# Altium project Urukul.PrjPCB (part 3 of 4)

## Sheet LEDs.SchDoc: =DocumentName
size A4; DocumentNumber: 1; Revision: 0; SheetNumber: 5; SheetTotal: 20
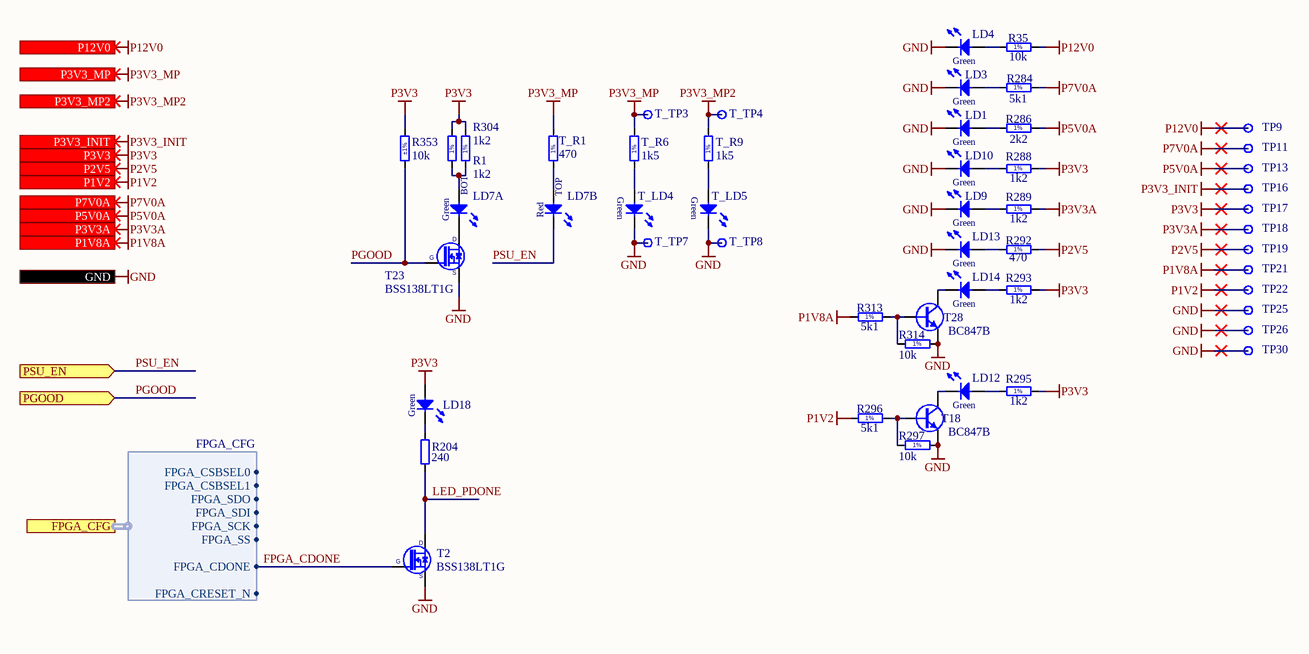
[diagram p4: LEDs.SchDoc]

### Parts
LD1  Green  [LED_KINGBRIGHT_KPH-1608CGCK]
LD3  Green  [LED_KINGBRIGHT_KPH-1608CGCK]
LD4  Green  [LED_KINGBRIGHT_KPH-1608CGCK]
LD7  Red/Green  [LED_DIALIGHT_571-0112F]  (value not drawn)  (parts A,B of 2)
LD9  Green  [LED_KINGBRIGHT_KPH-1608CGCK]
LD10  Green  [LED_KINGBRIGHT_KPH-1608CGCK]
LD12  Green  [LED_KINGBRIGHT_KPH-1608CGCK]
LD13  Green  [LED_KINGBRIGHT_KPH-1608CGCK]
LD14  Green  [LED_KINGBRIGHT_KPH-1608CGCK]
LD18  Green  [LED_AVAGO_HSME-C120]
R1  1k2  [RESC1608X55N]
R35  10k  [RESC1005X40N]
R204  240  [RESC1005X40N]
R284  5k1  [RESC1005X40N]
R286  2k2  [RESC1005X40N]
R288  1k2  [RESC1608X55N]
R289  1k2  [RESC1608X55N]
R292  470  [RESC1005X40N]
R293  1k2  [RESC1608X55N]
R295  1k2  [RESC1608X55N]
R296  5k1  [RESC1005X40N]
R297  10k  [RESC1005X40N]
R304  1k2  [RESC1608X55N]
R313  5k1  [RESC1005X40N]
R314  10k  [RESC1005X40N]
R353  10k  Tolerance: ±1%  [RESC1005X40N]
T2  BSS138LT1G  [SOT95P240X110-3N]
T18  BC847B  [SOT95P230X110-3N]
T23  BSS138LT1G  [SOT95P240X110-3N]
T28  BC847B  [SOT95P230X110-3N]
T_LD4  Green  [LED_KINGBRIGHT_KPH-1608CGCK]  (value not drawn)
T_LD5  Green  [LED_KINGBRIGHT_KPH-1608CGCK]  (value not drawn)
T_R1  470  [RESC1005X40N]
T_R6  1k5  [RESC1608X55N]
T_R9  1k5  [RESC1608X55N]
T_TP3  Test Point  [TPS127]  (value not drawn)  (no BOM)
T_TP4  Test Point  [TPS127]  (value not drawn)  (no BOM)
T_TP7  Test Point  [TPS127]  (value not drawn)  (no BOM)
T_TP8  Test Point  [TPS127]  (value not drawn)  (no BOM)
TP9  Test Point  [TPS127]  (value not drawn)  (no BOM)
TP11  Test Point  [TPS127]  (value not drawn)  (no BOM)
TP13  Test Point  [TPS127]  (value not drawn)  (no BOM)
TP16  Test Point  [TPS127]  (value not drawn)  (no BOM)
TP17  Test Point  [TPS127]  (value not drawn)  (no BOM)
TP18  Test Point  [TPS127]  (value not drawn)  (no BOM)
TP19  Test Point  [TPS127]  (value not drawn)  (no BOM)
TP21  Test Point  [TPS127]  (value not drawn)  (no BOM)
TP22  Test Point  [TPS127]  (value not drawn)  (no BOM)
TP25  Test Point  [TPS127]  (value not drawn)  (no BOM)
TP26  Test Point  [TPS127]  (value not drawn)  (no BOM)
TP30  Test Point  [TPS127]  (value not drawn)  (no BOM)

### Ports
FPGA_CFG (harness FPGA_CFG), GND, P1V2 (in), P1V8A (in), P2V5 (in), P3V3 (in), P3V3_INIT (in), P3V3_MP2 (in), P3V3_MP (in), P3V3A (in), P5V0A (in), P7V0A (in), P12V0 (in), PGOOD (in), PSU_EN (in)

### Harnesses
FPGA_CFG: FPGA_CSBSEL0, FPGA_CSBSEL1, FPGA_SDO, FPGA_SDI, FPGA_SCK, FPGA_SS, FPGA_CDONE, FPGA_CRESET_N

### Nets
GND: LD1.1(C) LD3.1(C) LD4.1(C) LD9.1(C) LD10.1(C) LD13.1(C) R297.2 R314.2 T2.2(S) T18.2(E) T23.2(S) T28.2(E) T_LD4.1(C) T_LD5.1(C) T_TP7.1 T_TP8.1 TP25.1 TP26.1 TP30.1 ; port GND
P1V2: R296.1 TP22.1 ; port P1V2
P1V8A: R313.1 TP21.1 ; port P1V8A
P2V5: R292.1 TP19.1 ; port P2V5
P3V3: LD18.2(A) R1.2 R288.2 R293.2 R295.2 R304.2 R353.2 TP17.1 ; port P3V3
P3V3_INIT: TP16.1 ; port P3V3_INIT
P3V3_MP: T_R1.1 T_R6.2 T_TP3.1 ; port P3V3_MP
P3V3_MP2: T_R9.2 T_TP4.1 ; port P3V3_MP2
P3V3A: R289.2 TP18.1 ; port P3V3A
P5V0A: R286.2 TP13.1 ; port P5V0A
P7V0A: R284.2 TP11.1 ; port P7V0A
P12V0: R35.2 TP9.1 ; port P12V0
FPGA_CDONE: T2.1(G) ; port FPGA_CFG.FPGA_CDONE  [project net FPGA_CFG.FPGA_CDONE]
LED_PDONE: R204.1 T2.3(D)
PGOOD: R353.1 T23.1(G) ; port PGOOD  [project net PGOOD_AFE]
PSU_EN: LD7.3(C) ; port PSU_EN
NetLD1_2: LD1.2(A) R286.1
NetLD3_2: LD3.2(A) R284.1
NetLD4_2: LD4.2(A) R35.1
NetLD7_1: LD7.1(C) T23.3(D)
NetLD7_2: LD7.2(A) R1.1 R304.1
NetLD7_4: LD7.4(A) T_R1.2
NetLD9_2: LD9.2(A) R289.1
NetLD10_2: LD10.2(A) R288.1
NetLD12_1: LD12.1(C) T18.3(C)
NetLD12_2: LD12.2(A) R295.1
NetLD13_2: LD13.2(A) R292.2
NetLD14_1: LD14.1(C) T28.3(C)
NetLD14_2: LD14.2(A) R293.1
NetLD18_1: LD18.1(C) R204.2
NetR296_2: R296.2 R297.1 T18.1(B)
NetR313_2: R313.2 R314.1 T28.1(B)
NetT_LD4_2: T_LD4.2(A) T_R6.1
NetT_LD5_2: T_LD5.2(A) T_R9.1

### Notes on the sheet
- Filename:
- Project:
- SINARA
  LOGO
  TBD
- Originally released by:
- Last modified by:
- Last reviewed by:
- Size:
- Version:
- Last mod. date :
- Sheet:
- A4
- Copyright =P_copyright_owner
  This source describes Open Hardware and is licensed under the CERN-OHL-W v1. You may redistribute and modify this documentation and make products using it under the terms of the CERN-OHL-W v1 (https:/cern.ch/cern-ohl). This documentation is distributed WITHOUT ANY EXPRESS OR IMPLIED WARRANTY, INCLUDING OF MERCHANTABILITY, SATISFACTORY QUALITY AND FITNESS FOR A PARTICULAR PURPOSE. Please see the CERN-OHL-W v1 for applicable conditions.
  As per CERN-OHL-W 1 section 4.1, should You produce hardware based on these sources, You must maintain the Source Location visible on the external case of the product you make using this documentation.
  Source location: =P_github_link
- Sinara Opern Hardware:
- https://github.com/sinara-hw
- (in symbol LED_DIALIGHT_571-0112F, part A) BOT; Green
- (in symbol LED_DIALIGHT_571-0112F, part B) TOP; Red
- (in symbol R0402_2K2_1%_0.0625W_100PPM) 1%
- (in symbol R0402_5K1_1%_0.0625W_100PPM) 1%
- (in symbol R0402_10K_1%_0.0625W_100PPM) 1%
- (in symbol R0402_470R_1%_0.0625W_100PPM) 1%
- (in symbol R0603_1K2_1%_0.1W_100PPM) 1%
- (in symbol R0603_1K5_1%_0.1W_100PPM) 1%

### Library data of the parts
LD1 LD3 LD4 LD9 LD10 LD12-LD14 T_LD4 T_LD5 = LED_KINGBRIGHT_KPH-1608CGCK: LED Green 1C 2A; Part Description: SMD Green LED, Case 1.6mmX0.8mm(0603), 0.65mm Thickness; PressFit: No; Bonding: No; Part Number: LED_KINGBRIGHT_KPH-1608CGCK; Component Kind: Standard; Component Type: Standard; Color: Green; PackageDescription: SMT Green LED, Case 0603, Body L 1.6 x W 0.8mm H 0.65mm; Manufacturer: KINGBRIGHT; Manufacturer Part Number: KPH-1608CGCK; Pin Count: 2; Mounted: Yes; Socket: No; SMD: Yes; Sense: No; ComponentHeight: 0.65mm; HelpURL: \\cern.ch\dfs\Applications\Altium\Datasheets\LED_KINGBRIGHT_KPH-1608CGCK.pdf; Author: CERN DEM JLC
  LD1 LD3 LD4 LD9 LD10 LD12-LD14: CreateDate: 03/07/2017; LatestRevisionDate: 03/07/2017
  T_LD4 T_LD5: CreateDate: 03.07.2017; LatestRevisionDate: 03.07.2017
LD7 = LED_DIALIGHT_571-0112F: 2x LED  Botom Green, Top Red; Part Description: Dual 2mm  LEDs, Red Top,Green Bot, CBI® Circuit Board Indicator (Without positioning pins); PressFit: No; Bonding: No; Part Number: LED_DIALIGHT_571-0112F; Component Kind: Standard; Component Type: Standard; Color: Red/Green; PackageDescription: 2x 2mm LED (Top: Red, Bot: Green) PCB Edge Mounting (Without positioning pins) DIALIGHT 571 Serie; Manufacturer: DIALIGHT; Manufacturer Part Number: 571-0112F; Pin Count: 4; Mounted: Yes; Socket: No; SMD: No; Sense: No; ComponentHeight: 8.6mm; HelpURL: \\cern.ch\dfs\Applications\Altium\Datasheets\LED_DIALIGHT_571-0112F.pdf; Author: CERN DEM JLC; CreateDate: 09.11.2009; LatestRevisionDate: 17.03.2010
LD18 = LED_AVAGO_HSME-C120: LED Green 1C 2A; Part Description: High Performance Right Angle Chip Green LED; Manufacturer: AVAGO TECHNOLOGIES; PressFit: No; Bonding: No; Part Number: LED_AVAGO_HSME-C120; Component Kind: Standard; Component Type: Standard; Color: Green; PackageDescription: Green Chip LED, 2-Leads, Body 1.7x1.1mm, Side Emitting Package; Manufacturer Part Number: HSME-C120; Pin Count: 2; Mounted: Yes; Socket: No; SMD: Yes; Sense: No; ComponentHeight: 0.7mm; HelpURL: \\cern.ch\dfs\Applications\Altium\Datasheets\LED_AVAGO_HSME-C120.pdf; ComponentLink1URL: \\cern.ch\dfs\Applications\Altium\Datasheets\LED_AVAGO_HSME-C110_DESIGN-GUIDE.pdf; ComponentLink1Description: Design Guide; Author: CERN DEM JMW; CreateDate: 22.07.2009; LatestRevisionDate: 20.06.2012
R1 R288 R289 R293 R295 R304 = R0603_1K2_1%_0.1W_100PPM: Resistor - 1%; Part Description: General Purpose Thick Film Chip Resistor; Manufacturer: GENERIC; Manufacturer1 Part Number: NRC06F1201TRF; Power: 0.1W; TC: ±100ppm/°C; Part Number: R0603_1K2_1%_0.1W_100PPM; Component Kind: Standard; Component Type: Standard; Pin Count: 2; Value: 1k2; Status: Preferred; Tolerance: ±1%; Manufacturer Part Number: R0603_1K2_1%_0.1W_100PPM; Case: 0603; Mounted: Yes; Sense: No; Socket: No; SMD: Yes; Manufacturer1 Example: NIC COMPONENT; Manufacturer1 ComponentHeight: 0.55mm; HelpURL: \\cern.ch\dfs\Applications\Altium\Datasheets\R0603_NIC_NRC.pdf; Author: CERN DEM JLC; CreateDate: 03.12.2007; LatestRevisionDate: 13.03.2008
R35 R297 R314 R353 = R0402_10K_1%_0.0625W_100PPM: Resistor - 1%; Part Description: General Purpose Thick Film Chip Resistor; Manufacturer: GENERIC; Manufacturer1 Part Number: 232270671003L; TC: ±100ppm/°C; PressFit: No; Part Number: R0402_10K_1%_0.0625W_100PPM; Component Kind: Standard; Component Type: Standard; Pin Count: 2; Value: 10k; Status: Not Recommended; Power: 0.0625W; Manufacturer Part Number: R0402_10K_1%_0.0625W_100PPM; Case: 0402; Mounted: Yes; Sense: No; Socket: No; SMD: Yes; Manufacturer1 Example: YAGEO PHYCOMP; Manufacturer1 ComponentHeight: 0.4mm; HelpURL: \\cern.ch\dfs\Applications\Altium\Datasheets\R0402_Phycomp_RC0402.pdf; Author: CERN DEM JLC; CreateDate: 03.12.2007; LatestRevisionDate: 17.10.2012
  R35 R297 R314: Tolerance: ±1%
R204 = R0402_240R_1%_0.0625W_100PPM: Resistor - 1%; Part Description: General Purpose Thick Film Chip Resistor; Manufacturer: GENERIC; Manufacturer1 Part Number: 232270672401L; TC: ±100ppm/°C; PressFit: No; Part Number: R0402_240R_1%_0.0625W_100PPM; Component Kind: Standard; Component Type: Standard; Pin Count: 2; Value: 240; Status: Not Recommended; Power: 0.0625W; Tolerance: ±1%; Manufacturer Part Number: R0402_240R_1%_0.0625W_100PPM; Case: 0402; Mounted: Yes; Sense: No; Socket: No; SMD: Yes; Manufacturer1 Example: YAGEO PHYCOMP; Manufacturer1 ComponentHeight: 0.4mm; HelpURL: \\cern.ch\dfs\Applications\Altium\Datasheets\R0402_Phycomp_RC0402.pdf; Author: CERN DEM JLC; CreateDate: 03.12.2007; LatestRevisionDate: 17.10.2012
R284 R296 R313 = R0402_5K1_1%_0.0625W_100PPM: Resistor - 1%; Part Description: General Purpose Thick Film Chip Resistor; Manufacturer: GENERIC; Manufacturer1 Part Number: 232270675102L; TC: ±100ppm/°C; PressFit: No; Part Number: R0402_5K1_1%_0.0625W_100PPM; Component Kind: Standard; Component Type: Standard; Pin Count: 2; Value: 5k1; Status: Not Recommended; Power: 0.0625W; Tolerance: ±1%; Manufacturer Part Number: R0402_5K1_1%_0.0625W_100PPM; Case: 0402; Mounted: Yes; Sense: No; Socket: No; SMD: Yes; Manufacturer1 Example: YAGEO PHYCOMP; Manufacturer1 ComponentHeight: 0.4mm; HelpURL: \\cern.ch\dfs\Applications\Altium\Datasheets\R0402_Phycomp_RC0402.pdf; Author: CERN DEM JLC; CreateDate: 03.12.2007; LatestRevisionDate: 17.10.2012
R286 = R0402_2K2_1%_0.0625W_100PPM: Resistor - 1%; Part Description: General Purpose Thick Film Chip Resistor; Manufacturer: GENERIC; Manufacturer1 Part Number: 232270672202L; TC: ±100ppm/°C; Table: Resistors SMD; Part Number: R0402_2K2_1%_0.0625W_100PPM; Component Kind: Standard; Component Type: Standard; Pin Count: 2; Value: 2k2; Status: Not recommended; Power: 0.0625W; Tolerance: ±1%; Manufacturer Part Number: R0402_2K2_1%_0.0625W_100PPM; Case: 0402; Mounted: Yes; Socket: No; SMD: Yes; Manufacturer1 Example: YAGEO PHYCOMP; Manufacturer1 ComponentHeight: 0.4mm; HelpURL: \\cern.ch\dfs\Applications\Altium\Datasheets\R0402_Phycomp_RC0402.pdf; Author: CERN DEM JLC; CreateDate: 2007-12-03; LatestRevisionDate: 2012-10-17
R292 T_R1 = R0402_470R_1%_0.0625W_100PPM: Resistor - 1%; Part Description: General Purpose Thick Film Chip Resistor; Manufacturer: GENERIC; Manufacturer1 Part Number: 232270674701L; TC: ±100ppm/°C; PressFit: No; Part Number: R0402_470R_1%_0.0625W_100PPM; Component Kind: Standard; Component Type: Standard; Pin Count: 2; Value: 470; Status: Not Recommended; Power: 0.0625W; Tolerance: ±1%; Manufacturer Part Number: R0402_470R_1%_0.0625W_100PPM; Case: 0402; Mounted: Yes; Sense: No; Socket: No; SMD: Yes; Manufacturer1 Example: YAGEO PHYCOMP; Manufacturer1 ComponentHeight: 0.4mm; HelpURL: \\cern.ch\dfs\Applications\Altium\Datasheets\R0402_Phycomp_RC0402.pdf; Author: CERN DEM JLC; CreateDate: 03.12.2007; LatestRevisionDate: 17.10.2012
T2 = BSS138LT1G: N-CHANNEL MOSFET WITH DIODE; Part Description: 50V 200mA N-Channel Enhancement Mode Field-Effect Transistor; Manufacturer: ON SEMICONDUCTOR; PressFit: No; Bonding: No; Part Number: BSS138LT1G; Component Kind: Standard; Component Type: Standard; Device: BSS138LT1G; PackageDescription: SOT23 3-Leads, Pitch 0.95mm - Body 1.4x3mm, IPC Medium Density; Manufacturer Part Number: BSS138LT1G; Pin Count: 3; Case: SOT23-3; Mounted: Yes; Socket: No; SMD: Yes; Sense: No; ComponentHeight: 1.11mm; HelpURL: \\cern.ch\dfs\Applications\Altium\Datasheets\BSS138LT1G.pdf; Author: CERN DEM JLC; CreateDate: 23.03.2009; LatestRevisionDate: 23.03.2009
T18 T28 = BC847B: NPN Transistor; Part Description: 45V 100mA NPN general-purpose transistors; Manufacturer: NXP SEMICONDUCTORS; PressFit: No; Bonding: No; Part Number: BC847B; Component Kind: Standard; Component Type: Standard; Device: BC847B; PackageDescription: SOT23, 3 pin, Pitch 0.95mm - 1.3mm W X 2.9mm L X 1.1mm H, IPC Medium Density; Manufacturer Part Number: BC847B; Pin Count: 3; Case: SOT23-3; Mounted: Yes; Socket: No; SMD: Yes; Sense: No; ComponentHeight: 1.1mm; HelpURL: \\cern.ch\dfs\Applications\Altium\Datasheets\BC847B.pdf; Author: CERN DEM JLC; CreateDate: 14.06.2011; LatestRevisionDate: 14.06.2011
T23 = BSS138LT1G: N-CHANNEL MOSFET WITH DIODE; Part Description: 50V, 200mA N-Channel Enhancement Mode Field-Effect Transistor; Manufacturer: ON SEMICONDUCTOR; PressFit: No; Bonding: No; Part Number: BSS138LT1G; Component Kind: Standard; Component Type: Standard; Device: BSS138LT1G; PackageDescription: SOT23, 0.95mm Pitch; 3 Pin, 1.40mm W X 3.00mm L X 1.10mm H body, IPC Medium Density; Manufacturer Part Number: BSS138L; Pin Count: 3; Case: SOT23-3; Mounted: Yes; Socket: No; SMD: Yes; Sense: No; ComponentHeight: 1.11mm; HelpURL: \\cern.ch\dfs\Applications\Altium\Datasheets\BSS138LT1G.pdf; Author: CERN DEM JLC; CreateDate: 23.03.2009; LatestRevisionDate: 25.05.2022
T_R6 T_R9 = R0603_1K5_1%_0.1W_100PPM: Resistor - 1%; Part Description: General Purpose Thick Film Chip Resistor; Manufacturer: GENERIC; Manufacturer1 Part Number: NRC06F1501TRF; Power: 0.1W; TC: ±100ppm/°C; PressFit: No; Part Number: R0603_1K5_1%_0.1W_100PPM; Component Kind: Standard; Component Type: Standard; Pin Count: 2; Value: 1k5; Status: Preferred; Tolerance: ±1%; Manufacturer Part Number: R0603_1K5_1%_0.1W_100PPM; Case: 0603; Mounted: Yes; Sense: No; Socket: No; SMD: Yes; Manufacturer1 Example: NIC COMPONENT; Manufacturer1 ComponentHeight: 0.55mm; HelpURL: \\cern.ch\dfs\Applications\Altium\Datasheets\R0603_NIC_NRC.pdf; Author: CERN DEM JLC; CreateDate: 03.12.2007; LatestRevisionDate: 13.03.2008
T_TP3 T_TP4 T_TP7 T_TP8 TP9 TP11 TP13 TP16-TP19 TP21 TP22 TP25 TP26 TP30 = SMD_PAD_1.27X1.27MM: Part Description: 1.27mm x 1.27mm PCB Copper Area (SMD Test Point); Mounted: No; Part Number: SMD_PAD_1.27X1.27MM; Component Type: Standard (No BOM); Pin Count: 1; Family: Test Point; Socket: No; SMD: Yes; Sense: No; Status: None; ComponentHeight: 0mm; HelpURL: Undefined; Author: CERN DEM JLC; CreateDate: 12.01.2008; LatestRevisionDate: 12.01.2008; PackageDescription: 1.27mm x 1.27mm PCB Copper Area (SMD Test Point)

## Sheet FPGA.SchDoc: =DocumentName
size A3; DocumentNumber: 1; Revision: 0; SheetNumber: 16; SheetTotal: 20; Version: 1.6; Author 1: Grzegorz Kasprowicz; Author 2: Filip Światkowski, Paweł Kulik, Maciej Przybysz; Author 3: Krzysztof Belewicz; Github: https://github.com/sinara-hw/Urukul; Last modified by: Krzysztof Belewicz
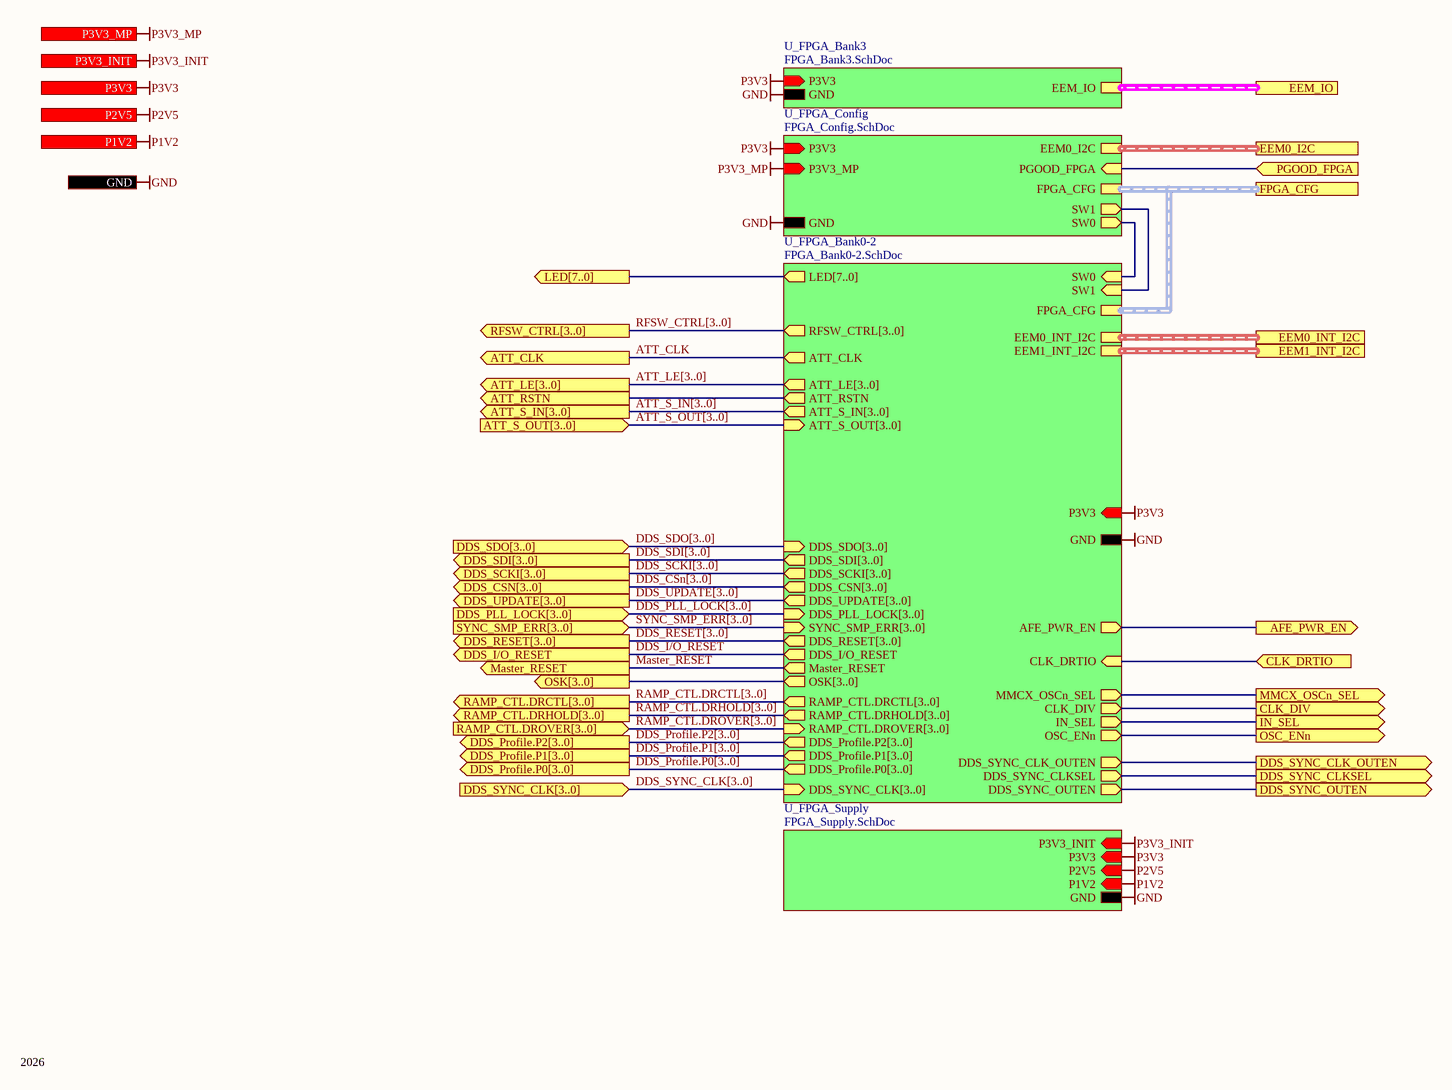
[diagram p5: FPGA.SchDoc]

### Sub-sheets
U_FPGA_Bank0-2 = FPGA_Bank0-2.SchDoc: EEM0_INT_I2C (harness I2C), EEM1_INT_I2C (harness I2C), LED[7..0] (out), FPGA_CFG (harness FPGA_CFG), SW0 (in), RFSW_CTRL[3..0] (out), DDS_SYNC_CLK[3..0] (in), ATT_S_IN[3..0] (out), ATT_S_OUT[3..0] (in), OSK[3..0] (out), ATT_CLK (out), ATT_LE[3..0] (out), ATT_RSTN (out), Master_RESET (out), DDS_UPDATE[3..0] (out), DDS_CSN[3..0] (out), DDS_SCKI[3..0] (out), DDS_SDI[3..0] (out), DDS_SDO[3..0] (in), DDS_I/O_RESET (out), DDS_PLL_LOCK[3..0] (in), SYNC_SMP_ERR[3..0] (in), DDS_RESET[3..0] (out), SW1 (in), GND, P3V3 (in), AFE_PWR_EN (out), DDS_SYNC_CLKSEL (out), DDS_SYNC_OUTEN (out), DDS_SYNC_CLK_OUTEN (out), IN_SEL (out), CLK_DIV (out), MMCX_OSCn_SEL (out), OSC_ENn (out), CLK_DRTIO (in), RAMP_CTL.DRCTL[3..0] (out), RAMP_CTL.DRHOLD[3..0] (out), RAMP_CTL.DROVER[3..0] (in), DDS_Profile.P2[3..0] (out), DDS_Profile.P1[3..0] (out), DDS_Profile.P0[3..0] (out)
U_FPGA_Bank3 = FPGA_Bank3.SchDoc (file not in this document): EEM_IO (harness EEM_LVDS), GND, P3V3 (in)
U_FPGA_Config = FPGA_Config.SchDoc: PGOOD_FPGA (in), FPGA_CFG (harness FPGA_CFG), SW0 (out), SW1 (out), GND, P3V3_MP (in), P3V3 (in), EEM0_I2C (harness I2C)
U_FPGA_Supply = FPGA_Supply.SchDoc: P3V3_INIT (in), P3V3 (in), P2V5 (in), P1V2 (in), GND

### Ports
AFE_PWR_EN (out), ATT_CLK (out), ATT_LE[3..0] (out), ATT_RSTN (out), ATT_S_IN[3..0] (out), ATT_S_OUT[3..0] (in), CLK_DIV (out), CLK_DRTIO (in), DDS_CSN[3..0] (out), DDS_I/O_RESET (out), DDS_PLL_LOCK[3..0] (in), DDS_Profile.P0[3..0] (out), DDS_Profile.P1[3..0] (out), DDS_Profile.P2[3..0] (out), DDS_RESET[3..0] (out), DDS_SCKI[3..0] (out), DDS_SDI[3..0] (out), DDS_SDO[3..0] (in), DDS_SYNC_CLK[3..0] (in), DDS_SYNC_CLK_OUTEN (out), DDS_SYNC_CLKSEL (out), DDS_SYNC_OUTEN (out), DDS_UPDATE[3..0] (out), EEM0_I2C (harness I2C), EEM0_INT_I2C (harness I2C), EEM1_INT_I2C (harness I2C), EEM_IO (harness EEM_LVDS), FPGA_CFG (harness FPGA_CFG), GND, IN_SEL (out), LED[7..0] (out), Master_RESET (out), MMCX_OSCn_SEL (out), OSC_ENn (out), OSK[3..0] (out), P1V2 (in), P2V5 (in), P3V3 (in), P3V3_INIT (in), P3V3_MP (in), PGOOD_FPGA (in), RAMP_CTL.DRCTL[3..0] (out), RAMP_CTL.DRHOLD[3..0] (out), RAMP_CTL.DROVER[3..0] (in), RFSW_CTRL[3..0] (out), SYNC_SMP_ERR[3..0] (in)

### Nets
GND: port GND, sheet U_FPGA_Supply/GND, sheet U_FPGA_Bank0-2/GND, sheet U_FPGA_Config/GND, sheet U_FPGA_Bank3/GND
P1V2: port P1V2, sheet U_FPGA_Supply/P1V2
P2V5: port P2V5, sheet U_FPGA_Supply/P2V5
P3V3: port P3V3, sheet U_FPGA_Supply/P3V3, sheet U_FPGA_Bank0-2/P3V3, sheet U_FPGA_Config/P3V3, sheet U_FPGA_Bank3/P3V3
P3V3_INIT: port P3V3_INIT, sheet U_FPGA_Supply/P3V3_INIT
P3V3_MP: port P3V3_MP, sheet U_FPGA_Config/P3V3_MP
AFE_PWR_EN: port AFE_PWR_EN, sheet U_FPGA_Bank0-2/AFE_PWR_EN
ATT_CLK: port ATT_CLK, sheet U_FPGA_Bank0-2/ATT_CLK
ATT_RSTn: port ATT_RSTN, sheet U_FPGA_Bank0-2/ATT_RSTN
CLK_DIV: port CLK_DIV, sheet U_FPGA_Bank0-2/CLK_DIV
CLK_DRTIO: port CLK_DRTIO, sheet U_FPGA_Bank0-2/CLK_DRTIO
DDS_I/O_RESET: port DDS_I/O_RESET, sheet U_FPGA_Bank0-2/DDS_I/O_RESET
DDS_SYNC_CLK_OUTEN: port DDS_SYNC_CLK_OUTEN, sheet U_FPGA_Bank0-2/DDS_SYNC_CLK_OUTEN
DDS_SYNC_CLKSEL: port DDS_SYNC_CLKSEL, sheet U_FPGA_Bank0-2/DDS_SYNC_CLKSEL
DDS_SYNC_OUTEN: port DDS_SYNC_OUTEN, sheet U_FPGA_Bank0-2/DDS_SYNC_OUTEN
I2C_OE: port PGOOD_FPGA, sheet U_FPGA_Config/PGOOD_FPGA
IN_SEL: port IN_SEL, sheet U_FPGA_Bank0-2/IN_SEL
Master_RESET: port Master_RESET, sheet U_FPGA_Bank0-2/Master_RESET
MMCX_OSCn_SEL: port MMCX_OSCn_SEL, sheet U_FPGA_Bank0-2/MMCX_OSCn_SEL
OSC_ENn: port OSC_ENn, sheet U_FPGA_Bank0-2/OSC_ENn
SW0: sheet U_FPGA_Bank0-2/SW0, sheet U_FPGA_Config/SW0
SW1: sheet U_FPGA_Bank0-2/SW1, sheet U_FPGA_Config/SW1

### Buses and harness runs
bus ATT_LE[3..0] = port ATT_LE[3..0] = sheet U_FPGA_Bank0-2/ATT_LE[3..0]
bus ATT_S_IN[3..0] = port ATT_S_IN[3..0] = sheet U_FPGA_Bank0-2/ATT_S_IN[3..0]
bus ATT_S_OUT[3..0] = port ATT_S_OUT[3..0] = sheet U_FPGA_Bank0-2/ATT_S_OUT[3..0]
bus DDS_CSn[3..0] = port DDS_CSN[3..0] = sheet U_FPGA_Bank0-2/DDS_CSN[3..0]
bus DDS_PLL_LOCK[3..0] = port DDS_PLL_LOCK[3..0] = sheet U_FPGA_Bank0-2/DDS_PLL_LOCK[3..0]
bus DDS_Profile.P0[3..0] = port DDS_Profile.P0[3..0] = sheet U_FPGA_Bank0-2/DDS_Profile.P0[3..0]
bus DDS_Profile.P1[3..0] = port DDS_Profile.P1[3..0] = sheet U_FPGA_Bank0-2/DDS_Profile.P1[3..0]
bus DDS_Profile.P2[3..0] = port DDS_Profile.P2[3..0] = sheet U_FPGA_Bank0-2/DDS_Profile.P2[3..0]
bus DDS_RESET[3..0] = port DDS_RESET[3..0] = sheet U_FPGA_Bank0-2/DDS_RESET[3..0]
bus DDS_SCKI[3..0] = port DDS_SCKI[3..0] = sheet U_FPGA_Bank0-2/DDS_SCKI[3..0]
bus DDS_SDI[3..0] = port DDS_SDI[3..0] = sheet U_FPGA_Bank0-2/DDS_SDI[3..0]
bus DDS_SDO[3..0] = port DDS_SDO[3..0] = sheet U_FPGA_Bank0-2/DDS_SDO[3..0]
bus DDS_SYNC_CLK[3..0] = port DDS_SYNC_CLK[3..0] = sheet U_FPGA_Bank0-2/DDS_SYNC_CLK[3..0]
bus DDS_UPDATE[3..0] = port DDS_UPDATE[3..0] = sheet U_FPGA_Bank0-2/DDS_UPDATE[3..0]
bus port LED[7..0] = sheet U_FPGA_Bank0-2/LED[7..0]
bus port OSK[3..0] = sheet U_FPGA_Bank0-2/OSK[3..0]
bus RAMP_CTL.DRCTL[3..0] = port RAMP_CTL.DRCTL[3..0] = sheet U_FPGA_Bank0-2/RAMP_CTL.DRCTL[3..0]
bus RAMP_CTL.DRHOLD[3..0] = port RAMP_CTL.DRHOLD[3..0] = sheet U_FPGA_Bank0-2/RAMP_CTL.DRHOLD[3..0]
bus RAMP_CTL.DROVER[3..0] = port RAMP_CTL.DROVER[3..0] = sheet U_FPGA_Bank0-2/RAMP_CTL.DROVER[3..0]
bus RFSW_CTRL[3..0] = port RFSW_CTRL[3..0] = sheet U_FPGA_Bank0-2/RFSW_CTRL[3..0]
bus SYNC_SMP_ERR[3..0] = port SYNC_SMP_ERR[3..0] = sheet U_FPGA_Bank0-2/SYNC_SMP_ERR[3..0]
harness port EEM0_I2C = sheet U_FPGA_Config/EEM0_I2C
harness port EEM0_INT_I2C = sheet U_FPGA_Bank0-2/EEM0_INT_I2C
harness port EEM1_INT_I2C = sheet U_FPGA_Bank0-2/EEM1_INT_I2C
harness port EEM_IO = sheet U_FPGA_Bank3/EEM_IO
harness port FPGA_CFG = sheet U_FPGA_Bank0-2/FPGA_CFG = sheet U_FPGA_Config/FPGA_CFG

### Notes on the sheet
- 2026
- SINARA
- Project:
- Designed by:
- Filename:
- Size:
- Version:
- Last mod. date :
- Sheet:
- A4
- Copyright _______________
  This source describes Open Hardware and is licensed under the CERN-OHL-W v2. You may redistribute and modify this documentation and make products using it under the terms of the CERN-OHL-W v2 (https:/cern.ch/cern-ohl). This documentation is distributed WITHOUT ANY EXPRESS OR IMPLIED WARRANTY, INCLUDING OF MERCHANTABILITY, SATISFACTORY QUALITY AND FITNESS FOR A PARTICULAR PURPOSE. Please see the CERN-OHL-W v2 for applicable conditions.
  As per CERN-OHL-W v2 section 4.1, should You produce hardware based on these sources, You must maintain the Source Location visible on the external case of the product you make using this documentation.
  Source location: =Github
- Last mod. by :

## Sheet FPGA_Supply.SchDoc: =DocumentName
size A3; DocumentNumber: 1; Revision: 0; SheetNumber: 19; SheetTotal: 20; Version: 1.6; Author 1: Grzegorz Kasprowicz; Author 2: Filip Światkowski, Paweł Kulik, Maciej Przybysz; Author 3: Krzysztof Belewicz; Github: https://github.com/sinara-hw/Urukul; Last modified by: Krzysztof Belewicz
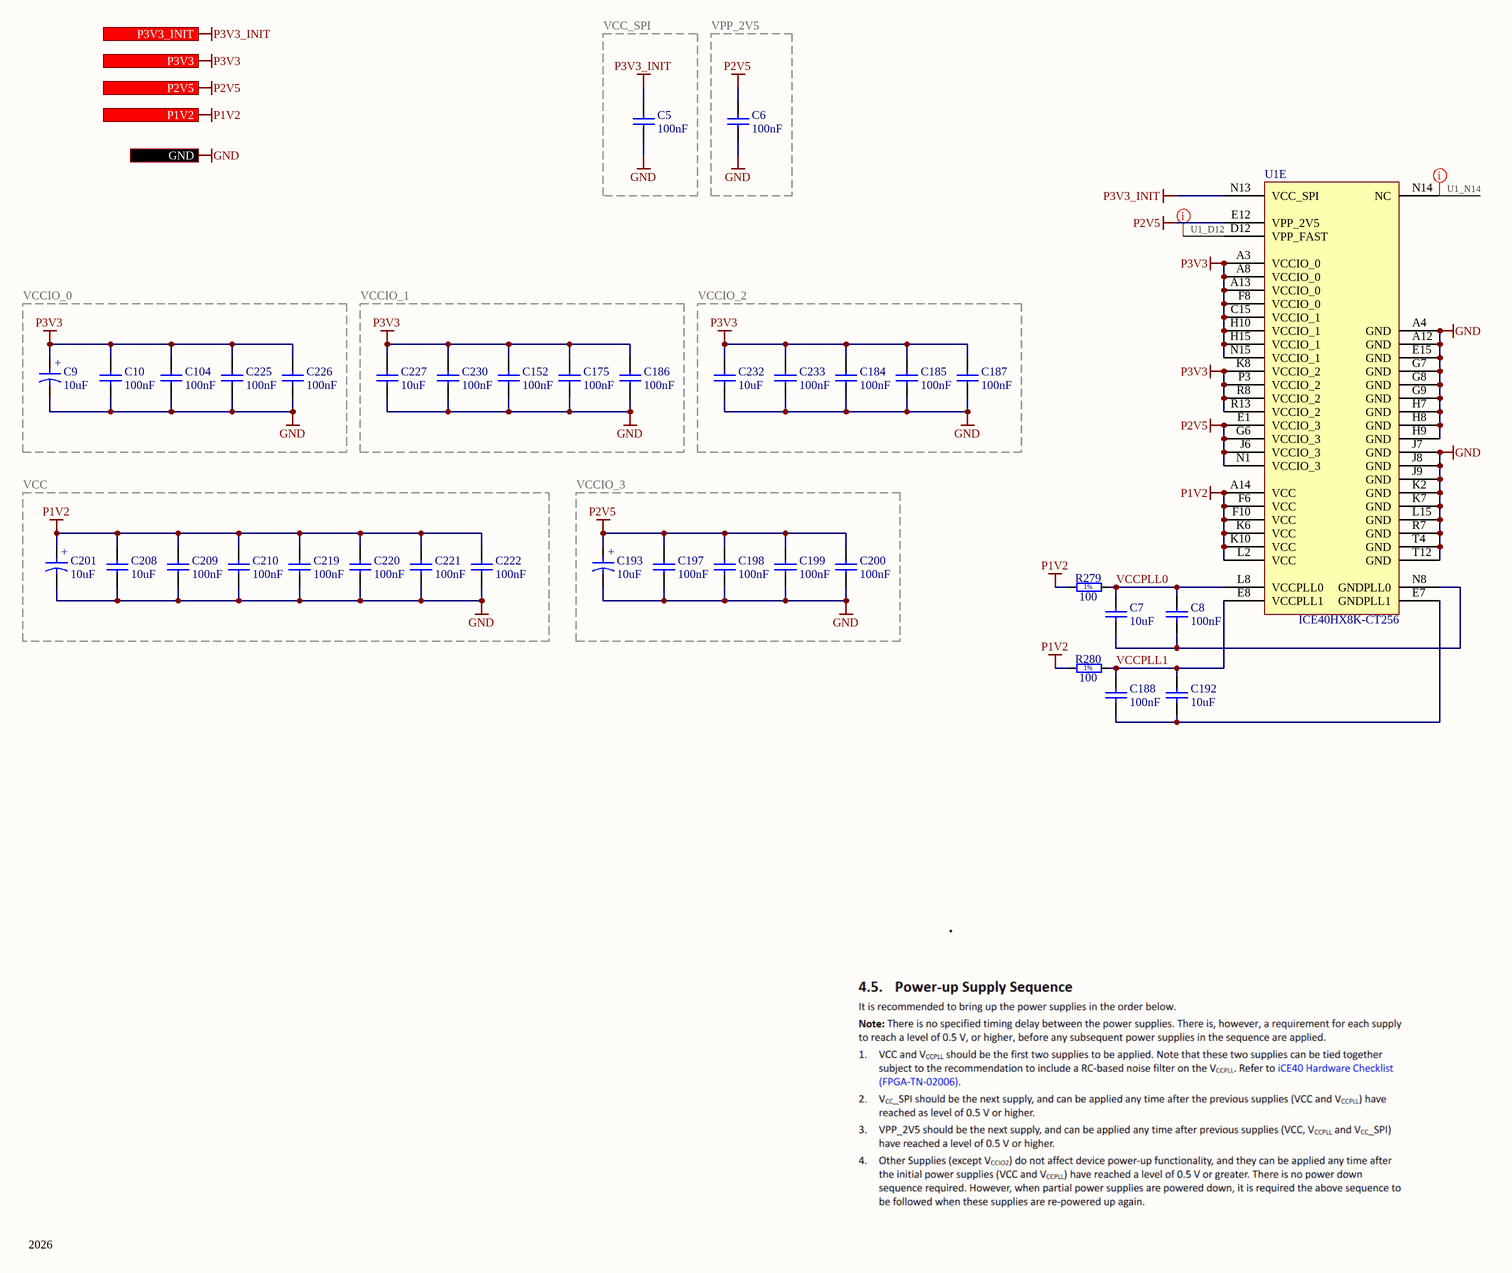
[diagram p6: FPGA_Supply.SchDoc]

### Parts
C5  100nF  [CAPC1005X55N]
C6  100nF  [CAPC1005X55N]
C7  10uF  [CAPC1005X70N]
C8  100nF  [CAPC1005X55N]
C9  10uF  [CAPMP3216X180N]
C10  100nF  [CAPC1005X55N]
C104  100nF  [CAPC1005X55N]
C152  100nF  [CAPC1005X55N]
C175  100nF  [CAPC1005X55N]
C184  100nF  [CAPC1005X55N]
C185  100nF  [CAPC1005X55N]
C186  100nF  [CAPC1005X55N]
C187  100nF  [CAPC1005X55N]
C188  100nF  [CAPC1005X55N]
C192  10uF  [CAPC1005X70N]
C193  10uF  [CAPMP3216X180N]
C197  100nF  [CAPC1005X55N]
C198  100nF  [CAPC1005X55N]
C199  100nF  [CAPC1005X55N]
C200  100nF  [CAPC1005X55N]
C201  10uF  [CAPMP3216X180N]
C208  10uF  [CAPC2012X135N]
C209  100nF  [CAPC1005X55N]
C210  100nF  [CAPC1005X55N]
C219  100nF  [CAPC1005X55N]
C220  100nF  [CAPC1005X55N]
C221  100nF  [CAPC1005X55N]
C222  100nF  [CAPC1005X55N]
C225  100nF  [CAPC1005X55N]
C226  100nF  [CAPC1005X55N]
C227  10uF  [CAPC2012X135N]
C230  100nF  [CAPC1005X55N]
C232  10uF  [CAPC2012X135N]
C233  100nF  [CAPC1005X55N]
R279  100  [RESC1005X40N]
R280  100  [RESC1005X40N]
U1  ICE40HX8K-CT256  [LATC-caBGA-256]  (part E of 5)

### Blocks framed on the sheet
VCC_SPI: C5
VPP_2V5: C6
VCCIO_0: C9 C10 C104 C225 C226
VCCIO_1: C152 C175 C186 C227 C230
VCCIO_2: C184 C185 C187 C232 C233
VCC: C201 C208-C210 C219-C222
VCCIO_3: C193 C197-C200

### Ports
GND, P1V2 (in), P2V5 (in), P3V3 (in), P3V3_INIT (in)

### Nets
GND: C5.1 C6.1 C9.2 C10.1 C104.1 C152.1 C175.1 C184.1 C185.1 C186.1 C187.1 C193.2 C197.1 C198.1 C199.1 C200.1 C201.2 C208.1 C209.1 C210.1 C219.1 C220.1 C221.1 C222.1 C225.1 C226.1 C227.1 C230.1 C232.1 C233.1 U1.A4(GND) U1.A12(GND) U1.E15(GND) U1.G7(GND) U1.G8(GND) U1.G9(GND) U1.H7(GND) U1.H8(GND) U1.H9(GND) U1.J7(GND) U1.J8(GND) U1.J9(GND) U1.K2(GND) U1.K7(GND) U1.L15(GND) U1.R7(GND) U1.T4(GND) U1.T12(GND) ; port GND
P1V2: C201.1 C208.2 C209.2 C210.2 C219.2 C220.2 C221.2 C222.2 R279.1 R280.1 U1.A14(VCC) U1.F6(VCC) U1.F10(VCC) U1.K6(VCC) U1.K10(VCC) U1.L2(VCC) ; port P1V2
P2V5: C6.2 C193.1 C197.2 C198.2 C199.2 C200.2 U1.E1(VCCIO_3) U1.E12(VPP_2V5) U1.G6(VCCIO_3) U1.J6(VCCIO_3) U1.N1(VCCIO_3) ; port P2V5
P3V3: C9.1 C10.2 C104.2 C152.2 C175.2 C184.2 C185.2 C186.2 C187.2 C225.2 C226.2 C227.2 C230.2 C232.2 C233.2 U1.A3(VCCIO_0) U1.A8(VCCIO_0) U1.A13(VCCIO_0) U1.C15(VCCIO_1) U1.F8(VCCIO_0) U1.H10(VCCIO_1) U1.H15(VCCIO_1) U1.K8(VCCIO_2) U1.N15(VCCIO_1) U1.P3(VCCIO_2) U1.R8(VCCIO_2) U1.R13(VCCIO_2) ; port P3V3
P3V3_INIT: C5.2 U1.N13(VCC_SPI) ; port P3V3_INIT
U1_D12: U1.D12(VPP_FAST)
U1_N14: U1.N14(NC)
VCCPLL0: C7.2 C8.2 R279.2 U1.L8(VCCPLL0)
VCCPLL1: C188.2 C192.2 R280.2 U1.E8(VCCPLL1)
NetC7_1: C7.1 C8.1 U1.N8(GNDPLL0)
NetC188_1: C188.1 C192.1 U1.E7(GNDPLL1)

### Layout directives
net class Unused: U1_D12, U1_N14

### Notes on the sheet
- 2026
- SINARA
- Project:
- Designed by:
- Filename:
- Size:
- Version:
- Last mod. date :
- Sheet:
- A4
- Copyright _______________
  This source describes Open Hardware and is licensed under the CERN-OHL-W v2. You may redistribute and modify this documentation and make products using it under the terms of the CERN-OHL-W v2 (https:/cern.ch/cern-ohl). This documentation is distributed WITHOUT ANY EXPRESS OR IMPLIED WARRANTY, INCLUDING OF MERCHANTABILITY, SATISFACTORY QUALITY AND FITNESS FOR A PARTICULAR PURPOSE. Please see the CERN-OHL-W v2 for applicable conditions.
  As per CERN-OHL-W v2 section 4.1, should You produce hardware based on these sources, You must maintain the Source Location visible on the external case of the product you make using this documentation.
  Source location: =Github
- Last mod. by :
- (in symbol CTE3216-18_10UF_16V_20%_AVX_TCJ) +
- (in symbol R0402_100R_1%_0.0625W_100PPM) 1%

### Library data of the parts
C5 C6 C8 C10 C104 C152 C175 C184-C188 C197-C200 C209 C210 C219-C222 C225 C226 C230 C233 = CC0402_100NF_16V_10%_X5R: Non-polarised capacitor; Part Description: SMD Multilayer Chip Ceramic Capacitor; Manufacturer: GENERIC; Manufacturer1 Part Number: GRM155R61C104KA88D; Voltage: 16V; TC: X5R; Tolerance: ±10%; Table: Capacitors SMD; Part Number: CC0402_100NF_16V_10%_X5R; Component Kind: Standard; Component Type: Standard; Pin Count: 2; Value: 100nF; Status: None; Manufacturer Part Number: CC0402_100NF_16V_10%_X5R; Case: 0402; Mounted: Yes; Socket: No; SMD: Yes; Manufacturer1 Example: MURATA; Manufacturer1 ComponentHeight: 0.55mm; HelpURL: \\cern.ch\dfs\Applications\Altium\Datasheets\CC0402_X5R_MURATA_GRM.pdf; Author: CERN DEM JLC; CreateDate: 2013-12-10; LatestRevisionDate: 2013-12-10
C7 C192 = CC0402_10UF_6.3V_20%_X5R: Non-polarised capacitor; Part Description: SMD Multilayer Chip Ceramic Capacitor; Manufacturer: GENERIC; Manufacturer1 Part Number: C1005X5R0J106M050BC; Voltage: 6.3V; TC: X5R; Tolerance: ±10%; Part Number: CC0402_10UF_6.3V_20%_X5R; Component Kind: Standard; Component Type: Standard; Pin Count: 2; Value: 10uF; Status: Preferred; Manufacturer Part Number: CC0402_10UF_6.3V_20%_X5R; Case: 0402; Mounted: Yes; Socket: No; SMD: Yes; Manufacturer1 Example: TDK; Manufacturer1 ComponentHeight: 0.70mm; HelpURL: \\cern.ch\dfs\Applications\Altium\Datasheets\CC0402_X5R_TDK_C.pdf; Author: CERN DEM JLC; CreateDate: 07.01.2015; LatestRevisionDate: 07.01.2015; Sense: No
C9 C193 C201 = CTE3216-18_10UF_16V_20%_AVX_TCJ: Polarised capacitor; Part Description: ESR 0R200 Tantalum Solid Electrolytic Chip Capacitor with Conductive Polymer Electrode; Manufacturer: AVX; Manufacturer Part Number: TCJA106M016R0200 or  or TR3A106K016C1700; Voltage: 16V; Tolerance: ±20%; Part Number: CTE3216-18_10UF_16V_20%_AVX_TCJ; Component Kind: Standard; Component Type: Standard; Pin Count: 2; Value: 10uF; Status: Preferred; Case: A; Mounted: Yes; Socket: No; SMD: Yes; Sense: No; ComponentHeight: 1.8mm; HelpURL: \\cern.ch\dfs\Applications\Altium\Datasheets\CTE_AVX_TCJ.pdf; Author: CERN DEM JLC; CreateDate: 29.03.2012; LatestRevisionDate: 29.03.2012
C208 C227 C232 = CC0805_10UF_16V_10%_X5R: Non-polarised capacitor; Part Description: SMD Multilayer Chip Ceramic Capacitor; Manufacturer: GENERIC; Manufacturer1 Part Number: C0805C106K4PAC; Voltage: 16V; TC: X5R; Tolerance: ±10%; Part Number: CC0805_10UF_16V_10%_X5R; Component Kind: Standard; Component Type: Standard; Pin Count: 2; Value: 10uF; Status: Preferred; Manufacturer Part Number: CC0805_10UF_16V_10%_X5R; Case: 0805; Mounted: Yes; Socket: No; SMD: Yes; Manufacturer1 Example: KEMET; Manufacturer1 ComponentHeight: 1.4mm; HelpURL: \\cern.ch\dfs\Applications\Altium\Datasheets\CC1206_X5R_KEMET.pdf; Author: CERN DEM JLC; CreateDate: 03.12.2007; LatestRevisionDate: 03.12.2007; Sense: No
R279 R280 = R0402_100R_1%_0.0625W_100PPM: Resistor - 1%; Part Description: General Purpose Thick Film Chip Resistor; Manufacturer: GENERIC; Manufacturer1 Part Number: 232270671001L; TC: ±100ppm/°C; Table: Resistors SMD; Part Number: R0402_100R_1%_0.0625W_100PPM; Component Kind: Standard; Component Type: Standard; Pin Count: 2; Value: 100; Status: Not recommended; Power: 0.0625W; Tolerance: ±1%; Manufacturer Part Number: R0402_100R_1%_0.0625W_100PPM; Case: 0402; Mounted: Yes; Socket: No; SMD: Yes; Manufacturer1 Example: YAGEO PHYCOMP; Manufacturer1 ComponentHeight: 0.4mm; HelpURL: \\cern.ch\dfs\Applications\Altium\Datasheets\R0402_Phycomp_RC0402.pdf; Author: CERN DEM JLC; CreateDate: 2007-12-03; LatestRevisionDate: 2012-10-17
U1 = CMP-0962-00001-1: iCE40 HX8K Series FPGA Family, 7680 Logic Cells, 1.2 V Core, 128 K Embedded RAM Bits, 256-ball caBGA, Pb-Free, Tray; Manufacturer: Lattice Semiconductor; Supply Voltage: 1.2V; Phase-Locked Loops: 2; Logic Cells: 7680; Embedded RAM Bits: 128K; PackageReference: caBGA-256; PackageDescription: 256-Ball Chip Array Ball Grid Array, Body 14 x 14 mm, Pitch 0.8 mm; RoHS: TRUE; Packing: Tray; Mounting Technology: Surface Mount; ComponentLink3URL: http://www.latticesemi.com/lit/docs/package/pkg.pdf; ComponentLink1Description: Manufacturer URL; ComponentLink3Description: Package Specification; Code_JEDEC: MO-275; PackageVersion: Rev. 03.9, 02/2013; ComponentLink1URL: http://www.latticesemi.com/en; ComponentLink2URL: http://www.latticesemi.com/~/media/Documents/DataSheets/iCE/iCE40LPHXFamilyDataSheet.pdf; Manufacturer Part Number: ICE40HX8K-CT256; ComponentLink2Description: Datasheet; DatasheetVersion: Rev. 02.9; Part Number: ICE40HX8K-CT256

## Sheet FPGA_Bank0-2.SchDoc: =DocumentName
size A3; DocumentNumber: 1; Revision: 0; SheetNumber: 16; SheetTotal: 20; Version: 1.6; Author 1: Grzegorz Kasprowicz; Author 2: Filip Światkowski, Paweł Kulik, Maciej Przybysz; Author 3: Krzysztof Belewicz; Github: https://github.com/sinara-hw/Urukul; Last modified by: Krzysztof Belewicz
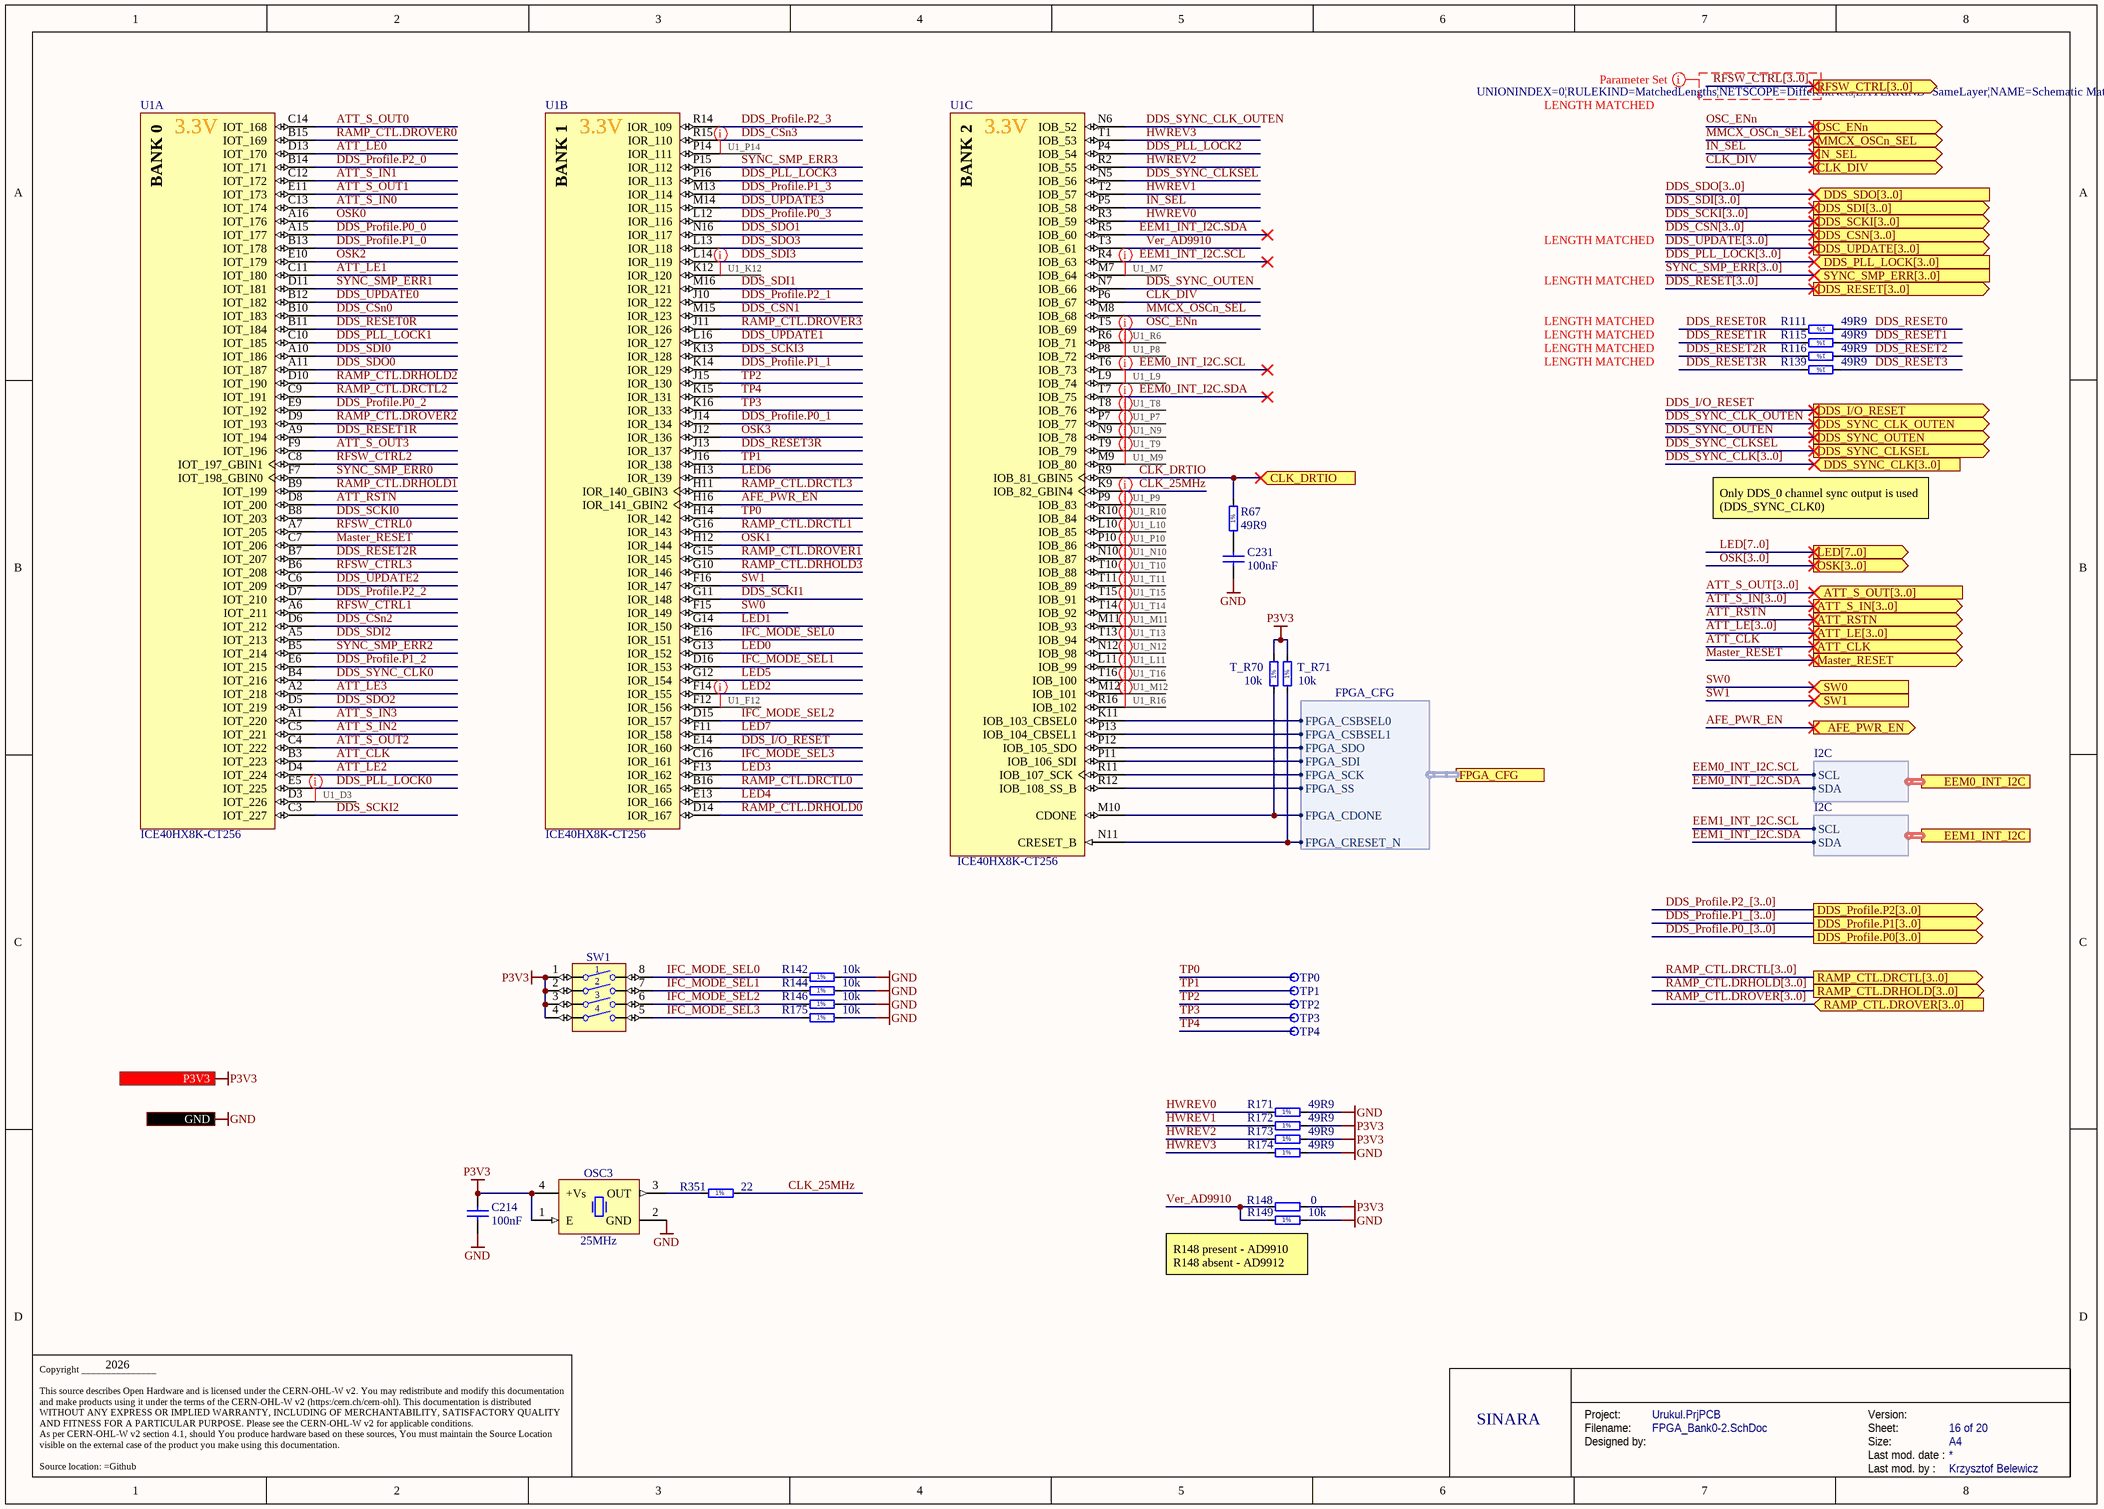
[diagram p7: FPGA_Bank0-2.SchDoc]

### Parts
C214  100nF  [CAPC1005X55N]
C231  100nF  [CAPC1005X55N]
OSC3  25MHz  [OSC_IQD_CFPS-39]
R67  49R9  [RESC1005X40N]
R111  49R9  [RESC1005X40N]
R115  49R9  [RESC1005X40N]
R116  49R9  [RESC1005X40N]
R139  49R9  [RESC1005X40N]
R142  10k  [RESC1005X40N]
R144  10k  [RESC1005X40N]
R146  10k  [RESC1005X40N]
R148  0  [RESC1005X40N]
R149  10k  [RESC1005X40N]
R171  49R9  [RESC1005X40N]
R172  49R9  [RESC1005X40N]
R173  49R9  [RESC1005X40N]
R174  49R9  [RESC1005X40N]
R175  10k  [RESC1005X40N]
R351  22  [RESC1005X40N]
SW1  Switch  [SW_TYCO_1571983-4]  (value not drawn)
T_R70  10k  [RESC1005X40N]
T_R71  10k  [RESC1005X40N]
TP0  Test Point  [TPS127]  (value not drawn)  (no BOM)
TP1  Test Point  [TPS127]  (value not drawn)  (no BOM)
TP2  Test Point  [TPS127]  (value not drawn)  (no BOM)
TP3  Test Point  [TPS127]  (value not drawn)  (no BOM)
TP4  Test Point  [TPS127]  (value not drawn)  (no BOM)
U1  ICE40HX8K-CT256  [LATC-caBGA-256]  (parts A,B,C of 5)

### Ports
AFE_PWR_EN (out), ATT_CLK (out), ATT_LE[3..0] (out), ATT_RSTN (out), ATT_S_IN[3..0] (out), ATT_S_OUT[3..0] (in), CLK_DIV (out), CLK_DRTIO (in), DDS_CSN[3..0] (out), DDS_I/O_RESET (out), DDS_PLL_LOCK[3..0] (in), DDS_Profile.P0[3..0] (out), DDS_Profile.P1[3..0] (out), DDS_Profile.P2[3..0] (out), DDS_RESET[3..0] (out), DDS_SCKI[3..0] (out), DDS_SDI[3..0] (out), DDS_SDO[3..0] (in), DDS_SYNC_CLK[3..0] (in), DDS_SYNC_CLK_OUTEN (out), DDS_SYNC_CLKSEL (out), DDS_SYNC_OUTEN (out), DDS_UPDATE[3..0] (out), EEM0_INT_I2C (harness I2C), EEM1_INT_I2C (harness I2C), FPGA_CFG (harness FPGA_CFG), GND, IN_SEL (out), LED[7..0] (out), Master_RESET (out), MMCX_OSCn_SEL (out), OSC_ENn (out), OSK[3..0] (out), P3V3 (in), RAMP_CTL.DRCTL[3..0] (out), RAMP_CTL.DRHOLD[3..0] (out), RAMP_CTL.DROVER[3..0] (in), RFSW_CTRL[3..0] (out), SW0 (in), SW1 (in), SYNC_SMP_ERR[3..0] (in)

### Harnesses
FPGA_CFG: FPGA_CSBSEL0, FPGA_CSBSEL1, FPGA_SDO, FPGA_SDI, FPGA_SCK, FPGA_SS, FPGA_CDONE, FPGA_CRESET_N
I2C: SDA, SCL

### Nets
GND: C214.1 C231.1 OSC3.2(GND) R142.1 R144.1 R146.1 R149.1 R171.1 R174.1 R175.1 ; port GND
P3V3: C214.2 OSC3.1(E) OSC3.4(+Vs) R148.2 R172.1 R173.1 SW1.1 SW1.2 SW1.3 SW1.4 T_R70.2 T_R71.2 ; port P3V3
AFE_PWR_EN: U1.H16(IOR_141_GBIN2) ; port AFE_PWR_EN
ATT_CLK: U1.B3(IOT_223) ; port ATT_CLK
ATT_LE0: U1.D13(IOT_170)
ATT_LE1: U1.C11(IOT_180)
ATT_LE2: U1.D4(IOT_224)
ATT_LE3: U1.A2(IOT_218)
ATT_RSTn: U1.D8(IOT_200) ; port ATT_RSTN
ATT_S_IN0: U1.C13(IOT_174)
ATT_S_IN1: U1.C12(IOT_172)
ATT_S_IN2: U1.C5(IOT_221)
ATT_S_IN3: U1.A1(IOT_220)
ATT_S_OUT0: U1.C14(IOT_168)
ATT_S_OUT1: U1.E11(IOT_173)
ATT_S_OUT2: U1.C4(IOT_222)
ATT_S_OUT3: U1.F9(IOT_196)
CLK_25MHz: R351.2 U1.K9(IOB_82_GBIN4)
CLK_DIV: U1.P6(IOB_67) ; port CLK_DIV
CLK_DRTIO: R67.2 U1.R9(IOB_81_GBIN5) ; port CLK_DRTIO
DDS_CSn0: U1.B10(IOT_183)
DDS_CSn1: U1.M15(IOR_123)
DDS_CSn2: U1.D6(IOT_212)
DDS_CSn3: U1.R15(IOR_110)
DDS_I/O_RESET: U1.E14(IOR_160) ; port DDS_I/O_RESET
DDS_PLL_LOCK0: U1.E5(IOT_225)
DDS_PLL_LOCK1: U1.C10(IOT_185)
DDS_PLL_LOCK2: U1.P4(IOB_54)
DDS_PLL_LOCK3: U1.P16(IOR_113)
DDS_Profile.P0_0: U1.A15(IOT_177)  [project net DDS_Profile.P00]
DDS_Profile.P0_1: U1.J14(IOR_134)  [project net DDS_Profile.P01]
DDS_Profile.P0_2: U1.E9(IOT_192)  [project net DDS_Profile.P02]
DDS_Profile.P0_3: U1.L12(IOR_116)  [project net DDS_Profile.P03]
DDS_Profile.P1_0: U1.B13(IOT_178)  [project net DDS_Profile.P10]
DDS_Profile.P1_1: U1.K14(IOR_129)  [project net DDS_Profile.P11]
DDS_Profile.P1_2: U1.E6(IOT_215)  [project net DDS_Profile.P12]
DDS_Profile.P1_3: U1.M13(IOR_114)  [project net DDS_Profile.P13]
DDS_Profile.P2_0: U1.B14(IOT_171)  [project net DDS_Profile.P20]
DDS_Profile.P2_1: U1.J10(IOR_122)  [project net DDS_Profile.P21]
DDS_Profile.P2_2: U1.D7(IOT_210)  [project net DDS_Profile.P22]
DDS_Profile.P2_3: U1.R14(IOR_109)  [project net DDS_Profile.P23]
DDS_RESET0: R111.1
DDS_RESET0R: R111.2 U1.B11(IOT_184)
DDS_RESET1: R115.1
DDS_RESET1R: R115.2 U1.A9(IOT_194)
DDS_RESET2: R116.1
DDS_RESET2R: R116.2 U1.B7(IOT_207)
DDS_RESET3: R139.1
DDS_RESET3R: R139.2 U1.J13(IOR_137)
DDS_SCKI0: U1.B8(IOT_203)
DDS_SCKI1: U1.G11(IOR_148)
DDS_SCKI2: U1.C3(IOT_227)
DDS_SCKI3: U1.K13(IOR_128)
DDS_SDI0: U1.A10(IOT_186)
DDS_SDI1: U1.M16(IOR_121)
DDS_SDI2: U1.A5(IOT_213)
DDS_SDI3: U1.L14(IOR_119)
DDS_SDO0: U1.A11(IOT_187)
DDS_SDO1: U1.N16(IOR_117)
DDS_SDO2: U1.D5(IOT_219)
DDS_SDO3: U1.L13(IOR_118)
DDS_SYNC_CLK0: U1.B4(IOT_216)
DDS_SYNC_CLK_OUTEN: U1.N6(IOB_52) ; port DDS_SYNC_CLK_OUTEN
DDS_SYNC_CLKSEL: U1.N5(IOB_56) ; port DDS_SYNC_CLKSEL
DDS_SYNC_OUTEN: U1.N7(IOB_66) ; port DDS_SYNC_OUTEN
DDS_UPDATE0: U1.B12(IOT_182)
DDS_UPDATE1: U1.L16(IOR_127)
DDS_UPDATE2: U1.C6(IOT_209)
DDS_UPDATE3: U1.M14(IOR_115)
EEM0_INT_I2C.SCL: U1.T6(IOB_73) ; port EEM0_INT_I2C.SCL  [project net I2C_A.SCL]
EEM0_INT_I2C.SDA: U1.T7(IOB_75) ; port EEM0_INT_I2C.SDA  [project net I2C_A.SDA]
EEM1_INT_I2C.SCL: U1.R4(IOB_63) ; port EEM1_INT_I2C.SCL  [project net I2C_A.SCL]
EEM1_INT_I2C.SDA: U1.R5(IOB_60) ; port EEM1_INT_I2C.SDA  [project net I2C_A.SDA]
FPGA_CFG.FPGA_CDONE: T_R70.1 U1.M10(CDONE) ; port FPGA_CFG.FPGA_CDONE
FPGA_CFG.FPGA_CRESET_N: T_R71.1 U1.N11(CRESET_B) ; port FPGA_CFG.FPGA_CRESET_N
FPGA_CFG.FPGA_CSBSEL0: U1.K11(IOB_103_CBSEL0) ; port FPGA_CFG.FPGA_CSBSEL0
FPGA_CFG.FPGA_CSBSEL1: U1.P13(IOB_104_CBSEL1) ; port FPGA_CFG.FPGA_CSBSEL1
FPGA_CFG.FPGA_SCK: U1.R11(IOB_107_SCK) ; port FPGA_CFG.FPGA_SCK
FPGA_CFG.FPGA_SDI: U1.P11(IOB_106_SDI) ; port FPGA_CFG.FPGA_SDI
FPGA_CFG.FPGA_SDO: U1.P12(IOB_105_SDO) ; port FPGA_CFG.FPGA_SDO
FPGA_CFG.FPGA_SS: U1.R12(IOB_108_SS_B) ; port FPGA_CFG.FPGA_SS
HWREV0: R171.2 U1.R3(IOB_59)
HWREV1: R172.2 U1.T2(IOB_57)
HWREV2: R173.2 U1.R2(IOB_55)
HWREV3: R174.2 U1.T1(IOB_53)
IFC_MODE_SEL0: R142.2 SW1.8 U1.E16(IOR_151)
IFC_MODE_SEL1: R144.2 SW1.7 U1.D16(IOR_153)
IFC_MODE_SEL2: R146.2 SW1.6 U1.D15(IOR_157)
IFC_MODE_SEL3: R175.2 SW1.5 U1.C16(IOR_161)
IN_SEL: U1.P5(IOB_58) ; port IN_SEL
LED0: U1.G13(IOR_152)
LED1: U1.G14(IOR_150)
LED2: U1.F14(IOR_155)
LED3: U1.F13(IOR_162)
LED4: U1.E13(IOR_166)
LED5: U1.G12(IOR_154)
LED6: U1.H13(IOR_139)
LED7: U1.F11(IOR_158)
Master_RESET: U1.C7(IOT_206) ; port Master_RESET
MMCX_OSCn_SEL: U1.M8(IOB_68) ; port MMCX_OSCn_SEL
OSC_ENn: U1.T5(IOB_69) ; port OSC_ENn
OSK0: U1.A16(IOT_176)  [project net OSK00]
OSK1: U1.H12(IOR_144)  [project net OSK01]
OSK2: U1.E10(IOT_179)  [project net OSK02]
OSK3: U1.J12(IOR_136)  [project net OSK03]
RAMP_CTL.DRCTL0: U1.B16(IOR_165)
RAMP_CTL.DRCTL1: U1.G16(IOR_143)
RAMP_CTL.DRCTL2: U1.C9(IOT_191)
RAMP_CTL.DRCTL3: U1.H11(IOR_140_GBIN3)
RAMP_CTL.DRHOLD0: U1.D14(IOR_167)
RAMP_CTL.DRHOLD1: U1.B9(IOT_199)
RAMP_CTL.DRHOLD2: U1.D10(IOT_190)
RAMP_CTL.DRHOLD3: U1.G10(IOR_146)
RAMP_CTL.DROVER0: U1.B15(IOT_169)
RAMP_CTL.DROVER1: U1.G15(IOR_145)
RAMP_CTL.DROVER2: U1.D9(IOT_193)
RAMP_CTL.DROVER3: U1.J11(IOR_126)
RFSW_CTRL0: U1.A7(IOT_205)
RFSW_CTRL1: U1.A6(IOT_211)
RFSW_CTRL2: U1.C8(IOT_197_GBIN1)
RFSW_CTRL3: U1.B6(IOT_208)
SW0: U1.F15(IOR_149) ; port SW0
SW1: U1.F16(IOR_147) ; port SW1
SYNC_SMP_ERR0: U1.F7(IOT_198_GBIN0)
SYNC_SMP_ERR1: U1.D11(IOT_181)
SYNC_SMP_ERR2: U1.B5(IOT_214)
SYNC_SMP_ERR3: U1.P15(IOR_112)
TP0: TP0.1 U1.H14(IOR_142)
TP1: TP1.1 U1.J16(IOR_138)
TP2: TP2.1 U1.J15(IOR_130)
TP3: TP3.1 U1.K16(IOR_133)
TP4: TP4.1 U1.K15(IOR_131)
U1_D3: U1.D3(IOT_226)
U1_F12: U1.F12(IOR_156)
U1_K12: U1.K12(IOR_120)
U1_L9: U1.L9(IOB_74)
U1_L10: U1.L10(IOB_85)
U1_L11: U1.L11(IOB_99)
U1_M7: U1.M7(IOB_64)
U1_M9: U1.M9(IOB_80)
U1_M11: U1.M11(IOB_93)
U1_M12: U1.M12(IOB_101)
U1_N9: U1.N9(IOB_78)
U1_N10: U1.N10(IOB_87)
U1_N12: U1.N12(IOB_98)
U1_P7: U1.P7(IOB_77)
U1_P8: U1.P8(IOB_72)
U1_P9: U1.P9(IOB_83)
U1_P10: U1.P10(IOB_86)
U1_P14: U1.P14(IOR_111)
U1_R6: U1.R6(IOB_71)
U1_R10: U1.R10(IOB_84)
U1_R16: U1.R16(IOB_102)
U1_T8: U1.T8(IOB_76)
U1_T9: U1.T9(IOB_79)
U1_T10: U1.T10(IOB_88)
U1_T11: U1.T11(IOB_89)
U1_T13: U1.T13(IOB_94)
U1_T14: U1.T14(IOB_92)
U1_T15: U1.T15(IOB_91)
U1_T16: U1.T16(IOB_100)
Ver_AD9910: R148.1 R149.2 U1.T3(IOB_61)
NetC231_2: C231.2 R67.1
NetOSC3_3: OSC3.3(OUT) R351.1

### Buses and harness runs
bus ATT_LE[3..0] = port ATT_LE[3..0]
bus ATT_S_IN[3..0] = port ATT_S_IN[3..0]
bus ATT_S_OUT[3..0] = port ATT_S_OUT[3..0]
bus DDS_CSN[3..0] = port DDS_CSN[3..0]
bus DDS_PLL_LOCK[3..0] = port DDS_PLL_LOCK[3..0]
bus DDS_Profile.P0_[3..0] = port DDS_Profile.P0[3..0]
bus DDS_Profile.P1_[3..0] = port DDS_Profile.P1[3..0]
bus DDS_Profile.P2_[3..0] = port DDS_Profile.P2[3..0]
bus DDS_RESET[3..0] = port DDS_RESET[3..0]
bus DDS_SCKI[3..0] = port DDS_SCKI[3..0]
bus DDS_SDI[3..0] = port DDS_SDI[3..0]
bus DDS_SDO[3..0] = port DDS_SDO[3..0]
bus DDS_SYNC_CLK[3..0] = port DDS_SYNC_CLK[3..0]
bus DDS_UPDATE[3..0] = port DDS_UPDATE[3..0]
bus LED[7..0] = port LED[7..0]
bus OSK[3..0] = port OSK[3..0]
bus RAMP_CTL.DRCTL[3..0] = port RAMP_CTL.DRCTL[3..0]
bus RAMP_CTL.DRHOLD[3..0] = port RAMP_CTL.DRHOLD[3..0]
bus RAMP_CTL.DROVER[3..0] = port RAMP_CTL.DROVER[3..0]
bus RFSW_CTRL[3..0] = port RFSW_CTRL[3..0]
bus SYNC_SMP_ERR[3..0] = port SYNC_SMP_ERR[3..0]

### Layout directives
rule Matched Net Lengths [Tolerance = 2.54mm]; net class RFSW: RFSW_CTRL[3..0]
net class Unused: U1_D3, U1_F12, U1_K12, U1_L9, U1_L10, U1_L11, U1_M7, U1_M9, U1_M11, U1_M12, U1_N9, U1_N10, U1_N12, U1_P7, U1_P8, U1_P9, U1_P10, U1_P14, U1_R6, U1_R10, U1_R16, U1_T8, U1_T9, U1_T10, U1_T11, U1_T13, U1_T14, U1_T15, U1_T16

### Notes on the sheet
- LENGTH MATCHED
- 3.3V
- Only DDS_0 channel sync output is used (DDS_SYNC_CLK0)
- (near R149) R148 present - AD9910
  R148 absent - AD9912
- 2026
- SINARA
- Project:
- Designed by:
- Filename:
- Size:
- Version:
- Last mod. date :
- Sheet:
- A4
- Copyright _______________
  This source describes Open Hardware and is licensed under the CERN-OHL-W v2. You may redistribute and modify this documentation and make products using it under the terms of the CERN-OHL-W v2 (https:/cern.ch/cern-ohl). This documentation is distributed WITHOUT ANY EXPRESS OR IMPLIED WARRANTY, INCLUDING OF MERCHANTABILITY, SATISFACTORY QUALITY AND FITNESS FOR A PARTICULAR PURPOSE. Please see the CERN-OHL-W v2 for applicable conditions.
  As per CERN-OHL-W v2 section 4.1, should You produce hardware based on these sources, You must maintain the Source Location visible on the external case of the product you make using this documentation.
  Source location: =Github
- Last mod. by :
- (in symbol CMP-0962-00001-1, part A) BANK 0
- (in symbol CMP-0962-00001-1, part B) BANK 1
- (in symbol CMP-0962-00001-1, part C) BANK 2
- (in symbol R0402_10K_1%_0.0625W_100PPM) 1%
- (in symbol R0402_22R_1%_0.0625W_100PPM) 1%
- (in symbol R0402_49R9_1%_0.0625W_100PPM) 1%

### Library data of the parts
C214 C231 = CC0402_100NF_16V_10%_X5R: Non-polarised capacitor; Part Description: SMD Multilayer Chip Ceramic Capacitor; Manufacturer: GENERIC; Manufacturer1 Part Number: GRM155R61C104KA88D; Voltage: 16V; TC: X5R; Tolerance: ±10%; Part Number: CC0402_100NF_16V_10%_X5R; Component Kind: Standard; Component Type: Standard; Pin Count: 2; Value: 100nF; Status: None; Manufacturer Part Number: CC0402_100NF_16V_10%_X5R; Case: 0402; Mounted: Yes; Socket: No; SMD: Yes; Sense: No; Manufacturer1 Example: MURATA; Manufacturer1 ComponentHeight: 0.55mm; HelpURL: \\cern.ch\dfs\Applications\Altium\Datasheets\CC0402_X5R_MURATA_GRM.pdf; Author: CERN DEM JLC; CreateDate: 10.12.2013; LatestRevisionDate: 10.12.2013
OSC3 = OSC_25MHZ_IQD_LFSPXO025165: Oscillator 4 pins 1=E 2=GND 3=OUT 4=+Vs; Part Description: 3.3V, ±50ppm, 15pF, -40 to 85°C, CMOS Surface Mount Clock Oscillator (CFPS-39 Series); Manufacturer: IQD FREQUENCY PRODUCTS; PressFit: No; Bonding: No; Part Number: OSC_25MHZ_IQD_LFSPXO025165; Component Kind: Standard; Component Type: Standard; PackageDescription: Oscillator, Corner Concave, 2.20mm Pitch, 4 Pins, 2.70mm L X 3.40mm W X 1.20mm H, CFPS-39 Series; Value: 25MHz; Manufacturer Part Number: LFSPXO025165; Pin Count: 4; Mounted: Yes; Socket: No; SMD: Yes; Sense: No; ComponentHeight: 1.2mm; HelpURL: \\cern.ch\dfs\Applications\Altium\Datasheets\OSC_IQD_LFSPXO025165.pdf; Author: CERN DEM JLC; CreateDate: 02.12.2010; LatestRevisionDate: 03.11.2016
R67 R111 R115 R116 R139 R171-R174 = R0402_49R9_1%_0.0625W_100PPM: Resistor - 1%; Part Description: General Purpose Thick Film Chip Resistor; Manufacturer: GENERIC; Manufacturer1 Part Number: 232270674999L or RC0402FR-0749R9L; TC: ±100ppm/°C; PressFit: No; Part Number: R0402_49R9_1%_0.0625W_100PPM; Component Kind: Standard; Component Type: Standard; Pin Count: 2; Value: 49R9; Status: Not Recommended; Power: 0.0625W; Tolerance: ±1%; Manufacturer Part Number: R0402_49R9_1%_0.0625W_100PPM; Case: 0402; Mounted: Yes; Sense: No; Socket: No; SMD: Yes; Manufacturer1 Example: YAGEO PHYCOMP; Manufacturer1 ComponentHeight: 0.4mm; HelpURL: \\cern.ch\dfs\Applications\Altium\Datasheets\R0402_Phycomp_RC0402.pdf; Author: CERN DEM JLC; CreateDate: 24.10.2012; LatestRevisionDate: 24.10.2012
R142 R144 R146 R149 R175 = R0402_10K_1%_0.0625W_100PPM: Resistor - 1%; Part Description: General Purpose Thick Film Chip Resistor; Manufacturer: GENERIC; Manufacturer1 Part Number: 232270671003L; TC: ±100ppm/°C; Part Number: R0402_10K_1%_0.0625W_100PPM; Component Kind: Standard; Component Type: Standard; Pin Count: 2; Value: 10k; Status: Not recommended; Power: 0.0625W; Tolerance: ±1%; Manufacturer Part Number: R0402_10K_1%_0.0625W_100PPM; Case: 0402; Mounted: Yes; Sense: No; Socket: No; SMD: Yes; Manufacturer1 Example: YAGEO PHYCOMP; Manufacturer1 ComponentHeight: 0.4mm; HelpURL: \\cern.ch\dfs\Applications\Altium\Datasheets\R0402_Phycomp_RC0402.pdf; Author: CERN DEM JLC; CreateDate: 03.12.2007; LatestRevisionDate: 17.10.2012
R148 = R0402_0R_JUMPER: Resistor; Part Description: 1A (0.05R Max DC Resistance) Zero Ohm Jumper; Manufacturer: GENERIC; Manufacturer1 Part Number: 232270591001L; Part Number: R0402_0R_JUMPER; Component Kind: Standard; Component Type: Standard; Pin Count: 2; Value: 0; Status: Not recommended; Manufacturer Part Number: R0402_0R_JUMPER; Case: 0402; Mounted: Yes; Sense: No; Socket: No; SMD: Yes; Manufacturer1 Example: YAGEO PHYCOMP; Manufacturer1 ComponentHeight: 0.4mm; HelpURL: \\cern.ch\dfs\Applications\Altium\Datasheets\R0402_Phycomp_RC0402.pdf; Author: CERN DEM JLC; CreateDate: 2007-12-03; LatestRevisionDate: 2012-10-17
R351 = R0402_22R_1%_0.0625W_100PPM: Resistor - 1%; Part Description: General Purpose Thick Film Chip Resistor; Manufacturer: GENERIC; Manufacturer1 Part Number: 232270672209L; TC: ±100ppm/°C; PressFit: No; Part Number: R0402_22R_1%_0.0625W_100PPM; Component Kind: Standard; Component Type: Standard; Pin Count: 2; Value: 22; Status: Not Recommended; Power: 0.0625W; Tolerance: ±1%; Manufacturer Part Number: R0402_22R_1%_0.0625W_100PPM; Case: 0402; Mounted: Yes; Sense: No; Socket: No; SMD: Yes; Manufacturer1 Example: YAGEO PHYCOMP; Manufacturer1 ComponentHeight: 0.4mm; HelpURL: \\cern.ch\dfs\Applications\Altium\Datasheets\R0402_Phycomp_RC0402.pdf; Author: CERN DEM JLC; CreateDate: 03/12/2007; LatestRevisionDate: 17/10/2012
SW1 = SW_TYCO_1571983-4: 4 Ways SPST DIP Switch; Part Description: 4 Way SPST SMD DIP Switch, Latched, Contact Rating 0.025A 24VDC; Manufacturer: TYCO; Manufacturer Part Number: 1571983-4 or GDH04S04; PressFit: No; Part Number: SW_TYCO_1571983-4; Component Kind: Standard; Component Type: Standard; Pin Count: 8; PackageDescription: Pitch 1.27mm,  Body 6.2x6.2mm, 4 Ways SPST Surface-Mount DIP Switch, TYCO GDH Series; Family: Switch; Mounted: Yes; Socket: No; SMD: Yes; Sense: No; Status: None; ComponentHeight: 2.31mm; HelpURL: \\cern.ch\dfs\Applications\Altium\Datasheets\SW_TYCO_1571983-4.pdf; Author: CERN DEM JLC; CreateDate: 08/01/2009; LatestRevisionDate: 08/01/2009
T_R70 T_R71 = R0402_10K_1%_0.0625W_100PPM: as R35 on sheet LEDs; Part Number: R0402_10K_1%_0.0625W_100PPM; Component Kind: Standard; Component Type: Standard; Pin Count: 2; Value: 10k; Status: Not Recommended; Power: 0.0625W; Tolerance: ±1%; Manufacturer Part Number: R0402_10K_1%_0.0625W_100PPM; Case: 0402; Mounted: Yes; Sense: No; Socket: No; SMD: Yes; Manufacturer1 Example: YAGEO PHYCOMP; Manufacturer1 ComponentHeight: 0.4mm; HelpURL: \\cern.ch\dfs\Applications\Altium\Datasheets\R0402_Phycomp_RC0402.pdf; Author: CERN DEM JLC; CreateDate: 03.12.2007; LatestRevisionDate: 17.10.2012
TP0-TP4 = SMD_PAD_1.27X1.27MM: as T_TP3 on sheet LEDs; Part Number: SMD_PAD_1.27X1.27MM; Component Type: Standard (No BOM); Pin Count: 1; Family: Test Point; Socket: No; SMD: Yes; Sense: No; Status: None; ComponentHeight: 0mm; HelpURL: Undefined; Author: CERN DEM JLC; CreateDate: 12.01.2008; LatestRevisionDate: 12.01.2008; PackageDescription: 1.27mm x 1.27mm PCB Copper Area (SMD Test Point)
U1 = CMP-0962-00001-1: as U1 on sheet FPGA_Supply; PackageReference: caBGA-256; PackageDescription: 256-Ball Chip Array Ball Grid Array, Body 14 x 14 mm, Pitch 0.8 mm; RoHS: TRUE; Packing: Tray; Mounting Technology: Surface Mount; ComponentLink3URL: http://www.latticesemi.com/lit/docs/package/pkg.pdf; ComponentLink1Description: Manufacturer URL; ComponentLink3Description: Package Specification; Code_JEDEC: MO-275; PackageVersion: Rev. 03.9, 02/2013; ComponentLink1URL: http://www.latticesemi.com/en; ComponentLink2URL: http://www.latticesemi.com/~/media/Documents/DataSheets/iCE/iCE40LPHXFamilyDataSheet.pdf; Manufacturer Part Number: ICE40HX8K-CT256; ComponentLink2Description: Datasheet; DatasheetVersion: Rev. 02.9; Part Number: ICE40HX8K-CT256